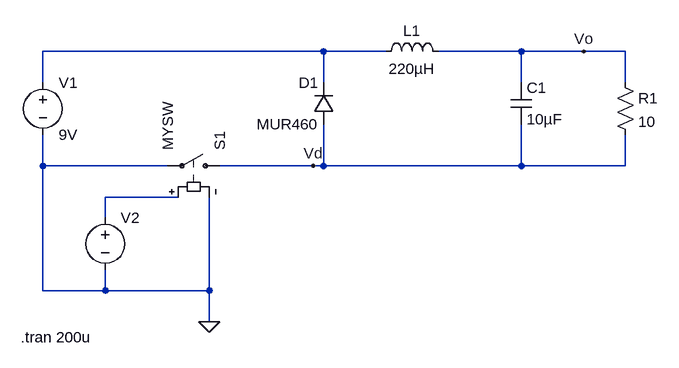
[diagram p0: schematic Punto 2 (Fuente Buck).asc]
Punto 2 (Fuente Buck).asc, the LTspice schematic file:
Version 4
SHEET 1 944 680
WIRE 416 96 -16 96
WIRE 512 96 416 96
WIRE 720 96 592 96
WIRE 816 96 720 96
WIRE 880 96 816 96
WIRE -16 144 -16 96
WIRE 416 144 416 96
WIRE 720 144 720 96
WIRE 880 144 880 96
WIRE -16 272 -16 224
WIRE 176 272 -16 272
WIRE 400 272 256 272
WIRE 416 272 416 208
WIRE 416 272 400 272
WIRE 720 272 720 208
WIRE 720 272 416 272
WIRE 880 272 880 224
WIRE 880 272 720 272
WIRE 192 320 80 320
WIRE 80 352 80 320
WIRE -16 464 -16 272
WIRE 80 464 80 432
WIRE 80 464 -16 464
WIRE 240 464 240 320
WIRE 240 464 80 464
WIRE 240 512 240 464
FLAG 240 512 0
FLAG 816 96 Vo
FLAG 400 272 Vd
SYMBOL voltage -16 128 R0
WINDOW 123 0 0 Left 0
WINDOW 39 0 0 Left 0
SYMATTR InstName V1
SYMATTR Value 9V
SYMBOL res 864 128 R0
SYMATTR InstName R1
SYMATTR Value 10
SYMBOL ind 496 112 R270
WINDOW 0 32 56 VTop 2
WINDOW 3 5 56 VBottom 2
SYMATTR InstName L1
SYMATTR Value 220µH
SYMBOL cap 704 144 R0
SYMATTR InstName C1
SYMATTR Value 10µF
SYMBOL sw 272 272 M270
SYMATTR InstName S1
SYMATTR Value MYSW
SYMBOL diode 432 208 R180
WINDOW 0 24 64 Left 2
WINDOW 3 24 0 Left 2
SYMATTR InstName D1
SYMATTR Value MUR460
SYMBOL voltage 80 336 R0
WINDOW 3 24 96 Invisible 2
WINDOW 123 0 0 Left 0
WINDOW 39 0 0 Left 0
SYMATTR InstName V2
SYMATTR Value PULSE(0 1 0 1n 1n 8.2222222u 20u)
TEXT -50 536 Left 2 !.tran 200u

The netlist it stands for:
* Punto 2 (Fuente Buck).asc
V1 N001 0 9V
R1 Vo Vd 10
L1 N001 Vo 220µH
C1 Vo Vd 10µF
S1 Vd 0 N002 0 MYSW
D1 Vd N001 MUR460
V2 N002 0 PULSE(0 1 0 1n 1n 8.2222222u 20u)
.model D D
.lib standard.dio
.tran 200u
.backanno
.end